# EAGLE design HominiPulseSensorControllerBoard (EAGLE 8.0.1)
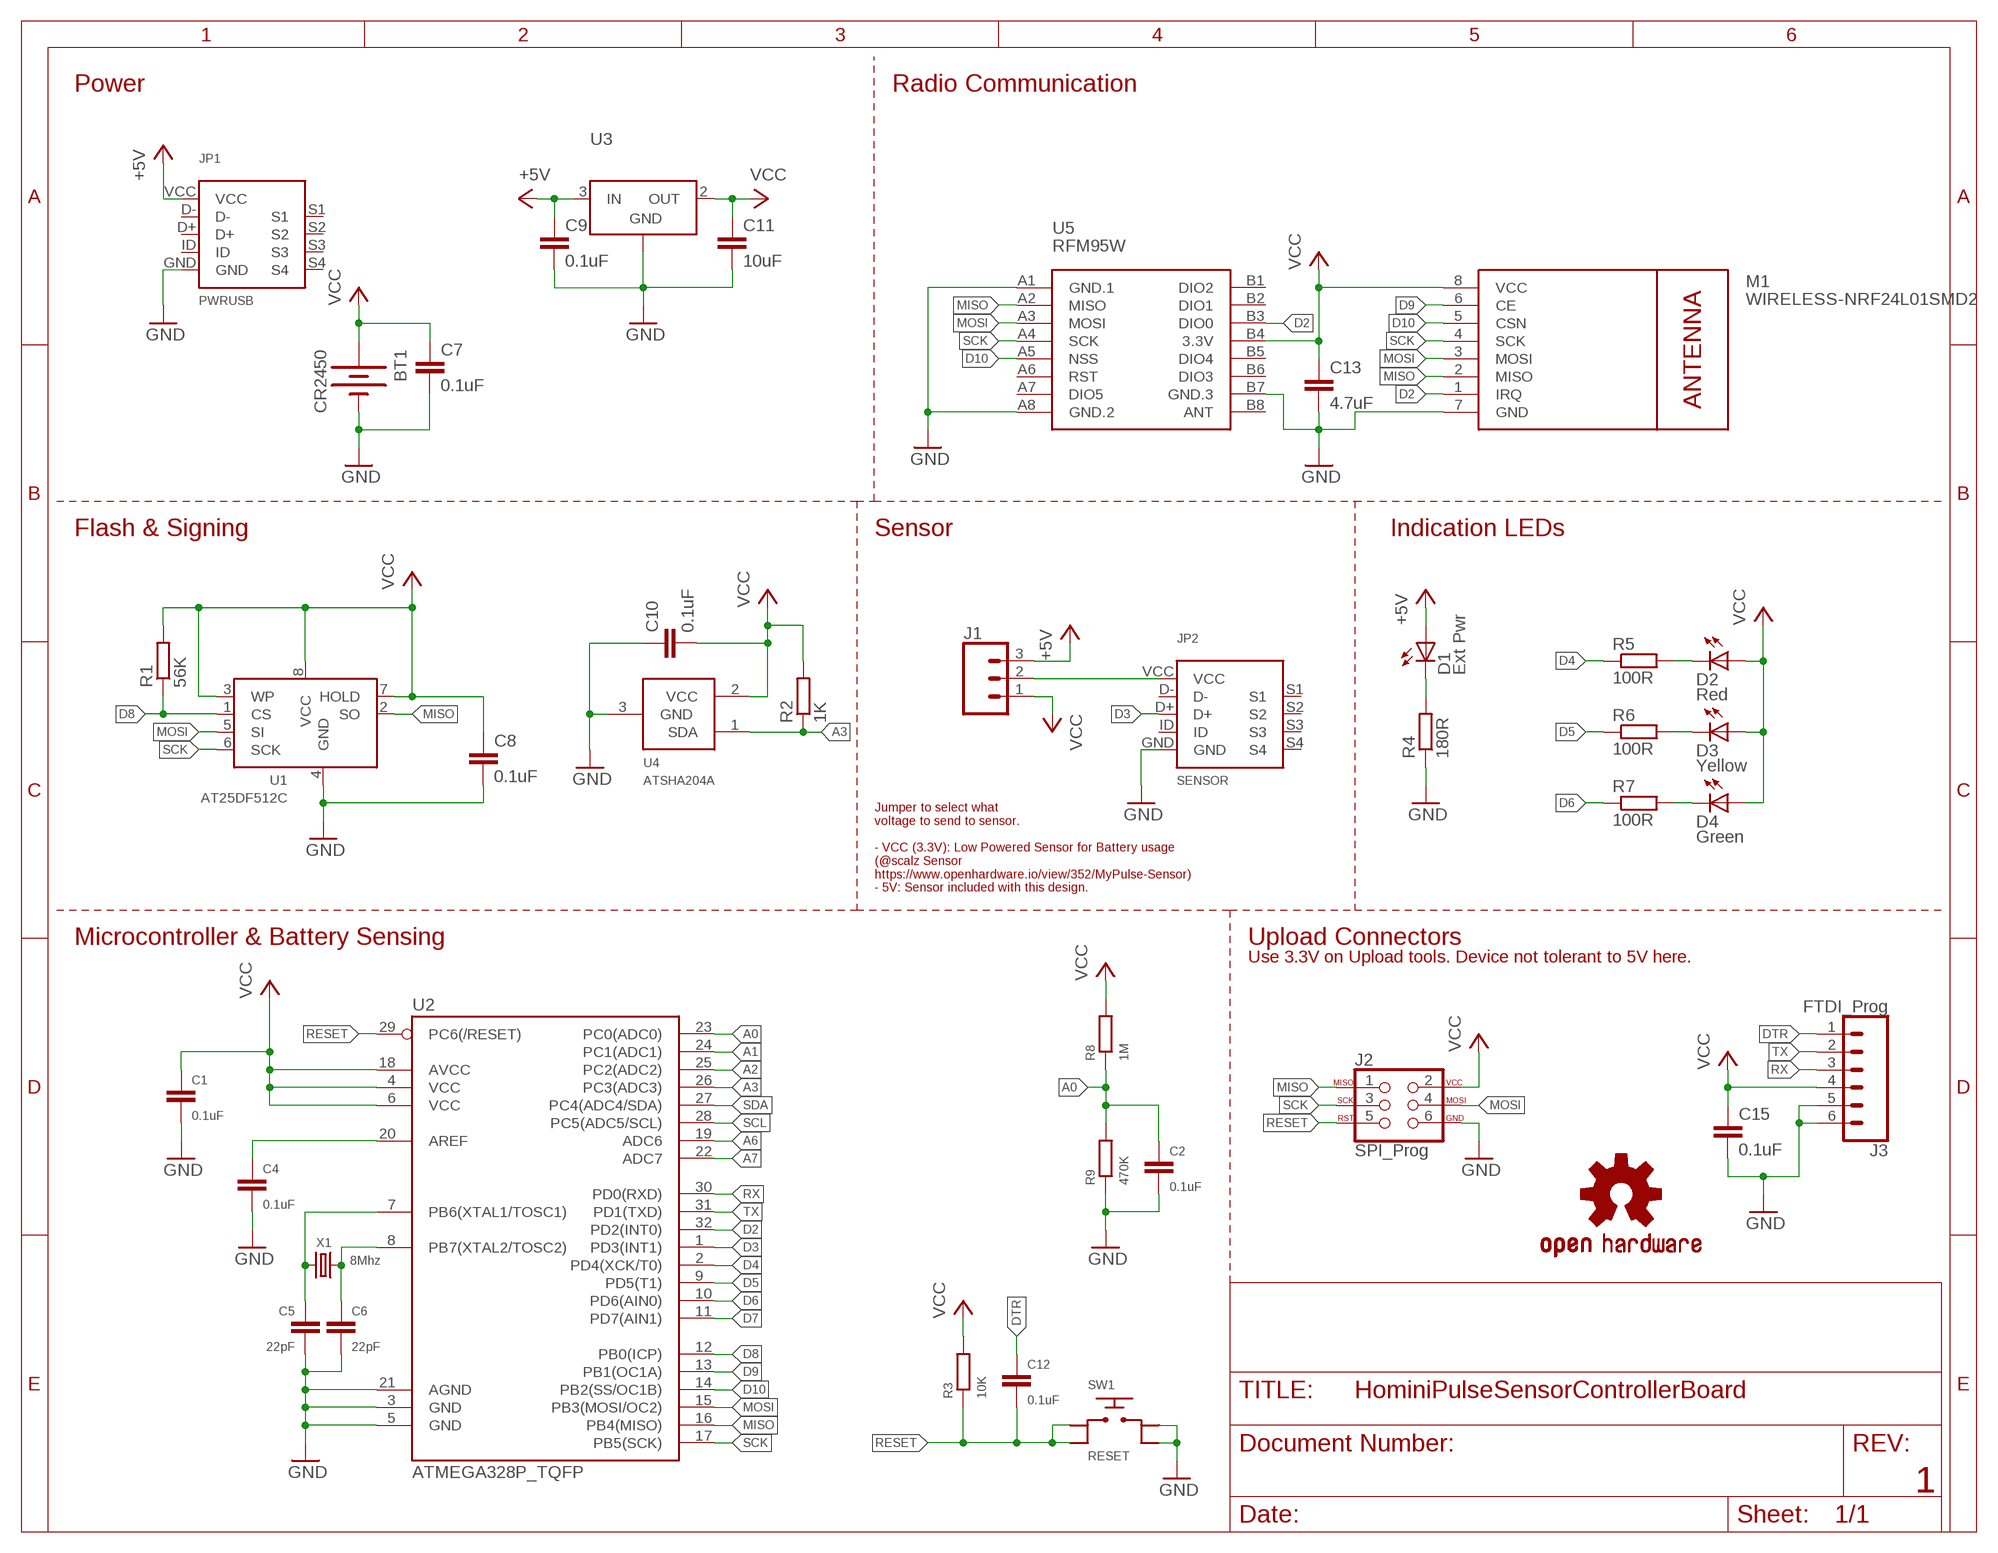
[diagram p0: schematic, sheet 1]

## Parts
BT1  CR2450  [BATTCON_24.5MM]
C1  0.1uF  C-EUC0603  [C0603]
C2  0.1uF  C-EUC0603  [C0603]
C4  0.1uF  C-EUC0603  [C0603]
C5  22pF  C-EUC0603  [C0603]
C6  22pF  C-EUC0603  [C0603]
C7  0.1uF  C-EUC0603  [C0603]
C8  0.1uF  C-EUC0603  [C0603]
C9  0.1uF  C-EUC0603  [C0603]
C10  0.1uF  C-EUC0603  [C0603]
C11  10uF  C-EUC0603  [C0603]
C12  0.1uF  C-EUC0603  [C0603]
C13  4.7uF  C-EUC0603  [C0603]
C15  0.1uF  C-EUC0603  [C0603]
D1  Ext Pwr  LED3MM  [LED3MM]
D2  Red  LED3MM  [LED3MM]
D3  Yellow  LED3MM  [LED3MM]
D4  Green  LED3MM  [LED3MM]
J1  CONN_03  [1X03]
J2  SPI_Prog  AVR_SPI_PROG_3X2PTH  [2X3]
J3  FTDI_Prog  CONN_06NO_SILK_FEMALE_PTH  [1X06_NO_SILK]
JP1  PWRUSB  MICROUSBSMD  [MICROUSBSMD]
JP2  SENSOR  MICROUSBSMD  [MICROUSBSMD]
LOGO1  OSHW-LOGOM  [OSHW-LOGO-M]
M1  WIRELESS-NRF24L01SMD2  [WIRELESS-NRF24L01-SMD-2]
R1  56K  R-EU_R0603  [R0603]
R2  1K  R-EU_R0603  [R0603]
R3  10K  R-EU_R0603  [R0603]
R4  180R  R-EU_R0603  [R0603]
R5  100R  R-EU_R0603  [R0603]
R6  100R  R-EU_R0603  [R0603]
R7  100R  R-EU_R0603  [R0603]
R8  1M  R-EU_R0603  [R0603]
R9  470K  R-EU_R0603  [R0603]
SW1  RESET  SMD5X5X1.5MM  [SMD5X5X1.5MM]
U1  AT25DF512C  [SOIC-8]
U2  ATMEGA328P_TQFP  [TQFP32-08]
U3  LD1117V33  [SOC-223]
U4  ATSHA204A  [SOT23]
U5  RFM95W  WIRELESS-LORA-RFM95W#SMD  [WIRELESS-LORA-RFM95W#SMD]
X1  8Mhz  HC-49S-SMT  [HC-49S-SMT]

## Nets
+5V: C9.1 D1.A J1.3 JP1.VCC U3.3(IN)
A0: C2.1 R8.1 R9.2 U2.23(PC0(ADC0))
A1: U2.24(PC1(ADC1))
A2: U2.25(PC2(ADC2))
A3: R2.1 U2.26(PC3(ADC3)) U4.1(SDA)
A6: U2.19(ADC6)
A7: U2.22(ADC7)
D2: M1.1(IRQ) U2.32(PD2(INT0)) U5.B3(DIO0)
D3: JP2.D+ U2.1(PD3(INT1))
D4: R5.1 U2.2(PD4(XCK/T0))
D5: R6.1 U2.9(PD5(T1))
D6: R7.1 U2.10(PD6(AIN0))
D7: U2.11(PD7(AIN1))
D8: R1.1 U1.1(CS) U2.12(PB0(ICP))
D9: M1.6(CE) U2.13(PB1(OC1A))
D10: M1.5(CSN) U2.14(PB2(SS/OC1B)) U5.A5(NSS)
DTR: C12.1 J3.1
GND: BT1.2(-) C1.2 C2.2 C4.2 C5.2 C6.2 C7.2 C8.2 C9.2 C10.1 C11.2 C13.2 C15.2 J2.6 J3.5 J3.6 JP1.GND JP2.GND M1.7(GND) R4.1 R9.1 SW1.3 SW1.4 U1.4(GND) U2.3(GND) U2.5(GND) U2.21(AGND) U3.1(GND) U4.3(GND) U5.A1(GND.1) U5.A8(GND.2) U5.B7(GND.3)
MISO: J2.1 M1.2(MISO) U1.2(SO) U2.16(PB4(MISO)) U5.A2(MISO)
MOSI: J2.4 M1.3(MOSI) U1.5(SI) U2.15(PB3(MOSI/OC2)) U5.A3(MOSI)
N$1: C6.1 U2.8(PB7(XTAL2/TOSC2)) X1.1
N$2: C5.1 U2.7(PB6(XTAL1/TOSC1)) X1.2
N$3: C4.1 U2.20(AREF)
N$4: J1.2 JP2.VCC
N$7: D1.K(C) R4.2
N$8: D2.K(C) R5.2
N$9: D3.K(C) R6.2
N$10: D4.K(C) R7.2
RESET: C12.2 J2.5 R3.1 SW1.1 SW1.2 U2.29(PC6(/RESET))
RX: J3.3 U2.30(PD0(RXD))
SCK: J2.3 M1.4(SCK) U1.6(SCK) U2.17(PB5(SCK)) U5.A4(SCK)
SCL: U2.28(PC5(ADC5/SCL))
SDA: U2.27(PC4(ADC4/SDA))
TX: J3.2 U2.31(PD1(TXD))
VCC: BT1.1(+) C1.1 C7.1 C8.1 C10.2 C11.1 C13.1 C15.1 D2.A D3.A D4.A J1.1 J2.2 J3.4 M1.8(VCC) R1.2 R2.2 R3.2 R8.2 U1.3(WP) U1.7(HOLD) U1.8(VCC) U2.4(VCC) U2.6(VCC) U2.18(AVCC) U3.2(OUT) U4.2(VCC) U5.B4(3.3V)
Unconnected: JP1.D+ JP1.D- JP1.ID JP1.S1 JP1.S2 JP1.S3 JP1.S4 JP2.D- JP2.ID JP2.S1 JP2.S2 JP2.S3 JP2.S4 U5.A6(RST) U5.A7(DIO5) U5.B1(DIO2) U5.B2(DIO1) U5.B5(DIO4) U5.B6(DIO3) U5.B8(ANT)

## Notes on the sheet
- Power | Radio Communication
- Flash & Signing | Sensor | Indication LEDs
- Jumper to select what 
  voltage to send to sensor.
  
  - VCC (3.3V): Low Powered Sensor for Battery usage
  (@scalz Sensor
  https://www.openhardware.io/view/352/MyPulse-Sensor)
  - 5V: Sensor included with this design.
- Microcontroller & Battery Sensing | Upload Connectors
- Use 3.3V on Upload tools. Device not tolerant to 5V here.
- 1

## Library data of the parts
BT1 = Misc:CR2450
C1 C2 C4-C13 C15 = rcl:C-EU: CAPACITOR, European symbol
D1-D4 = adafruit:LED: LED OSRAM: - CHIPLED LG R971, LG N971, LY N971, LG Q971, LY Q971, LO R971, LY R971 LH N974, LH R974 LS Q976, LO Q976, LY Q976 LO Q996 - Hyper CHIPLED LW Q18S LB Q993, LB Q99A, LB R99A - SideLED LS A670, LO A670, LY A670, LG A670, LP A670 LB A673, LV A673, LT A673, LW A673 LH A674 LY A675 LS A676, LA A676, LO A676, LY A676, LW A676 LS A679, LY A679, LG A679 - Hyper Micro SIDELED® LS Y876, LA Y876, LO Y876, LY Y876 LT Y87S - SmartLED LW L88C, LW L88S LB L89C, LB L89S, LG L890 LS L89K, LO L89K, LY L89K LS L896, LA L896, LO L896, LY L896 - TOPLED LS T670, LO T670, LY T670, LG T670, LP T670 LSG T670, LSP T670, LSY T670, LOP T670, LYG T670 LG T671, LOG T671, LSG T671 LB T673, LV T673, LT T673, LW T673 LH T674 LS T676, LA T676, LO T676, LY T676, LB T676, LH T676, LSB T676, LW T676 LB T67C, LV T67C, LT T67C, LS T67K, LO T67K, LY T67K, LW E67C LS E67B, LA E67B, LO E67B, LY E67B, LB E67C, LV E67C, LT E67C LW T67C LS T679, LY T679, LG T679 LS T770, LO T770, LY T770, LG T770, LP T770 LB T773, LV T773, LT T773, LW T773 LH T774 LS E675, LA E675, LY E675, LS T675 LS T776, LA T776, LO T776, LY T776, LB T776 LHGB T686 LT T68C, LB T68C - Hyper Mini TOPLED® LB M676 - Mini TOPLED Santana® LG M470 LS M47K, LO M47K, LY M47K Source: http://www.osram.convergy.de/
J1 = SparkFun-Connectors:CONN_03: Multi connection point. Often used as Generic Header-pin footprint for 0.1 inch spaced/style header connections On any of the 0.1 inch spaced packages, you can populate with these: Break Away Headers - Straight <https://www.sparkfun.com/products/116> (PRT-00116) Break Away Male Headers - Right Angle <https://www.sparkfun.com/products/553> (PRT-00553) Female Headers <https://www.sparkfun.com/products/115> (PRT-00115) Break Away Headers - Machine Pin <https://www.sparkfun.com/products/117> (PRT-00117) Break Away Female Headers - Swiss Machine Pin <https://www.sparkfun.com/products/743> (PRT-00743) Stackable Header - 3 Pin (Female, 0.1") <https://www.sparkfun.com/products/13875> (PRT-13875) For SCREWTERMINALS and SPRING TERMINALS visit here: Screw Terimnals on SparkFun.com <https://www.sparkfun.com/search/results?term=Screw+Terminals> (5mm/3.5mm/2.54mm spacing) This device is also useful as a general connection point to wire up your design to another part of your project. Our various solder wires solder well into these plated through hole pads. Hook-Up Wire - Assortment (Stranded, 22 AWG) <https://www.sparkfun.com/products/11375> (PRT-11375) Hook-Up Wire - Assortment (Solid Core, 22 AWG) <https://www.sparkfun.com/products/11367> (PRT-11367) View the entire wire category on our website here <https://www.sparkfun.com/categories/141> Special notes: Molex polarized connector foot print use with SKU : PRT-08232 with associated crimp pins and housings.
J2 = SparkFun-Connectors:AVR_SPI_PROG_3X2: AVR ISP 6 Pin This is the reduced ISP connector for AVR programming. Common on Arduino. This footprint will take up less PCB space and can be used with a 10-pin to 6-pin adapter such as SKU: BOB-08508 **Special note about "TEST_POINT" package. The stop mask is on the top side, so if you want your programming test points to be on the bottom of your board, make sure to place this package on the bottom side of the board. This also ensure that the orientation to program from the bottom side will be correct. SparkFun Products: SparkFun ISP Pogo Adapter <https://www.sparkfun.com/products/11591> - NS Tiny AVR Programmer <https://www.sparkfun.com/products/11801> -PTH
J3 = SparkFun-Connectors:CONN_06: Multi connection point. Often used as Generic Header-pin footprint for 0.1 inch spaced/style header connections On any of the 0.1 inch spaced packages, you can populate with these: Break Away Headers - Straight <https://www.sparkfun.com/products/116> (PRT-00116) Break Away Male Headers - Right Angle <https://www.sparkfun.com/products/553> (PRT-00553) Female Headers <https://www.sparkfun.com/products/115> (PRT-00115) Break Away Headers - Machine Pin <https://www.sparkfun.com/products/117> (PRT-00117) Break Away Female Headers - Swiss Machine Pin <https://www.sparkfun.com/products/743> (PRT-00743) Arduino Stackable Header - 6 Pin <https://www.sparkfun.com/products/9280> (PRT-09280) For SCREWTERMINALS and SPRING TERMINALS visit here: Screw Terimnals on SparkFun.com <https://www.sparkfun.com/search/results?term=Screw+Terminals> (5mm/3.5mm/2.54mm spacing) This device is also useful as a general connection point to wire up your design to another part of your project. Our various solder wires solder well into these plated through hole pads. Hook-Up Wire - Assortment (Stranded, 22 AWG) <https://www.sparkfun.com/products/11375> (PRT-11375) Hook-Up Wire - Assortment (Solid Core, 22 AWG) <https://www.sparkfun.com/products/11367> (PRT-11367) View the entire wire category on our website here <https://www.sparkfun.com/categories/141>; PROD_ID: CONN-08437
JP1 JP2 = Misc:MICROUSBSMD
LOGO1 = SparkFun-Aesthetics:OSHW-LOGO: Open-Source Hardware (OSHW) Logo This logo indicates the piece of hardware it is found on incorporates a OSHW license and/or adheres to the definition of open source hardware found here: http://freedomdefined.org/OSHW
M1 = nrf24l01SMD-GertSanders:WIRELESS-NRF24L01: 2.4 GHz Wireless Module based on NRF24L01 chip
R1-R9 = rcl:R-EU_: RESISTOR, European symbol
SW1 = Buttons:SMD5X5X1.5MM
U1 = Misc:AT25DF512C
U2 = SparkFun-IC-Microcontroller:ATMEGA328P_TQFP: Popular 328P in QFP Storefront component: ATmega328 - TQFP <https://www.sparkfun.com/products/13448> (COM-13448) Datasheet <http://www.sparkfun.com/datasheets/Components/SMD/ATMega328.pdf> SparkFun Products SparkFun RedBoard - Programmed with Arduino <https://www.sparkfun.com/products/12757> (DEV-12757) Arduino Pro Mini 328 - 5V/16MHz <https://www.sparkfun.com/products/11113> (DEV-11113) Arduino Pro Mini 328 - 3.3V/8MHz <https://www.sparkfun.com/products/11114> (DEV-11114) SparkFun OpenLog <https://www.sparkfun.com/products/13712> (DEV-13712) SparkFun MicroView - OLED Arduino Module <https://www.sparkfun.com/products/12923> (DEV-12923) SparkFun Digital Sandbox <https://www.sparkfun.com/products/12651> (DEV-12651) SparkFun PicoBoard <https://www.sparkfun.com/products/11888> (WIG-11888) Arduino Fio <https://www.sparkfun.com/products/10116> (DEV-10116) LilyPad Arduino 328 Main Board <https://www.sparkfun.com/products/13342> (DEV-13342) SparkFun RedStick <https://www.sparkfun.com/products/13741> (DEV-13741) LilyPad MP3 <https://www.sparkfun.com/products/11013> (DEV-11013) LilyPad Arduino SimpleSnap <https://www.sparkfun.com/products/10941> (DEV-10941) SparkFun Stepoko <https://www.sparkfun.com/products/13899> (ROB-13899) SparkFun Geiger Counter <https://www.sparkfun.com/products/11345> (SEN-11345) SparkFun EL Sequencer <https://www.sparkfun.com/products/12781> (COM-12781) Arduino Pro 328 - 5V/16MHz <https://www.sparkfun.com/products/10915> (DEV-10915) CryptoCape <https://www.sparkfun.com/products/12773> (DEV-12773) SparkFun IR Thermometer Evaluation Board - MLX90614 <https://www.sparkfun.com/products/10740> (SEN-10740) SparkFun RedBot Mainboard <https://www.sparkfun.com/products/12097> (ROB-12097) Arduino Pro 328 - 3.3V/8MHz <https://www.sparkfun.com/products/10914> (DEV-10914) SparkFun Block for Intel® Edison - Arduino <https://www.sparkfun.com/products/13036> (DEV-13036) SparkFun Simon Says - Surface Mount Soldering Kit <https://www.sparkfun.com/products/10935> (KIT-10935) SparkFun 7-Segment Serial Display - Red <https://www.sparkfun.com/products/11441> (COM-11441) SparkFun 7-Segment Serial Display - White <https://www.sparkfun.com/products/11629> (COM-11629) SparkFun 7-Segment Serial Display - Yellow <https://www.sparkfun.com/products/11443> (COM-11443) SparkFun 7-Segment Serial Display - Kelly Green <https://www.sparkfun.com/products/11440> (COM-11440) SparkFun 7-Segment Serial Display - Blue <https://www.sparkfun.com/products/11442> (COM-11442) SparkFun OpenSegment Serial Display - 20mm (Blue) <https://www.sparkfun.com/products/11647> (COM-11647) SparkFun OpenSegment Serial Display - 20mm (Green) <https://www.sparkfun.com/products/11646> (COM-11646) SparkFun OpenSegment Serial Display - 20mm (White) <https://www.sparkfun.com/products/11648> (COM-11648) SparkFun OpenSegment Serial Display - 20mm (Red) <https://www.sparkfun.com/products/11644> (COM-11644) SparkFun OpenSegment Serial Display - 20mm (Yellow) <https://www.sparkfun.com/products/11645> (COM-11645) SparkFun OpenSegment Shield <https://www.sparkfun.com/products/13190> (DEV-13190); PROD_ID: IC-09069
U3 = Misc:LD1117V33
U4 = Sensor:ATSHA204A
U5 = diy-modules:WIRELESS-LORA-RFM95W: 868/915 MHz LoRa Radio Transceiver Module based on SX1276 chip Click here to find device on ebay.com <http://www.ebay.com/sch/RFM95W+transceiver>
X1 = crystal2:HC-49S-SMT

## Board
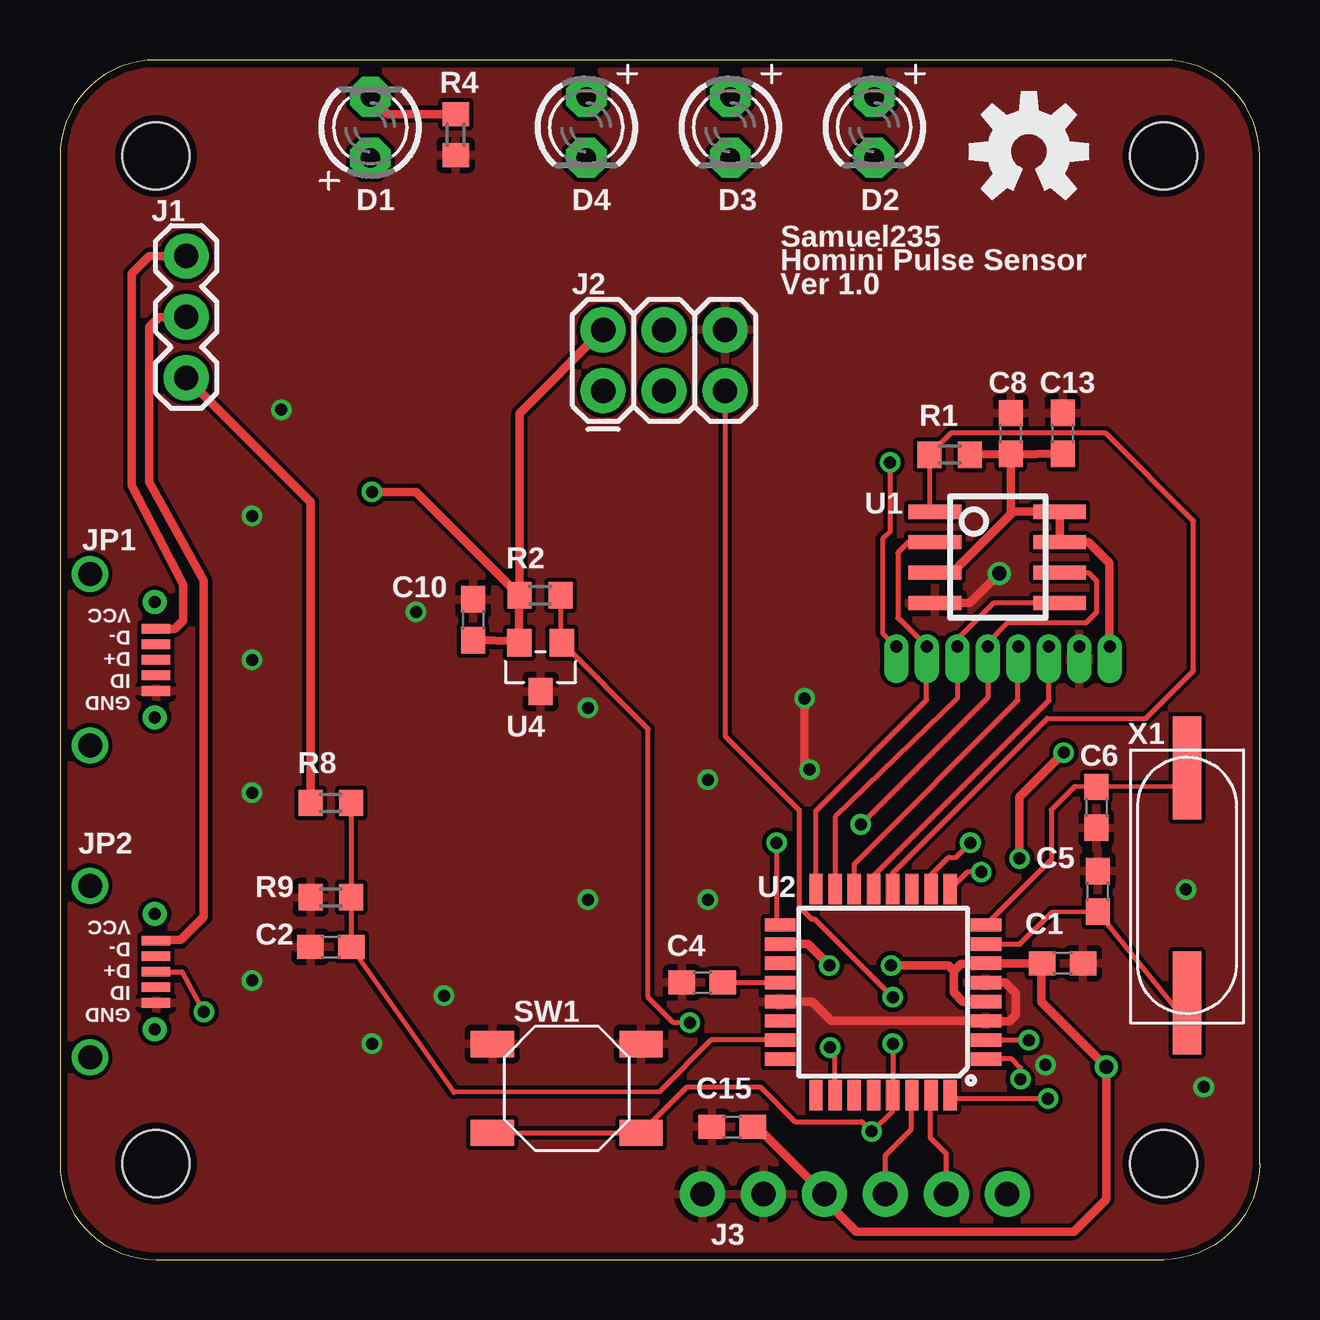
[diagram p1: board, top side]
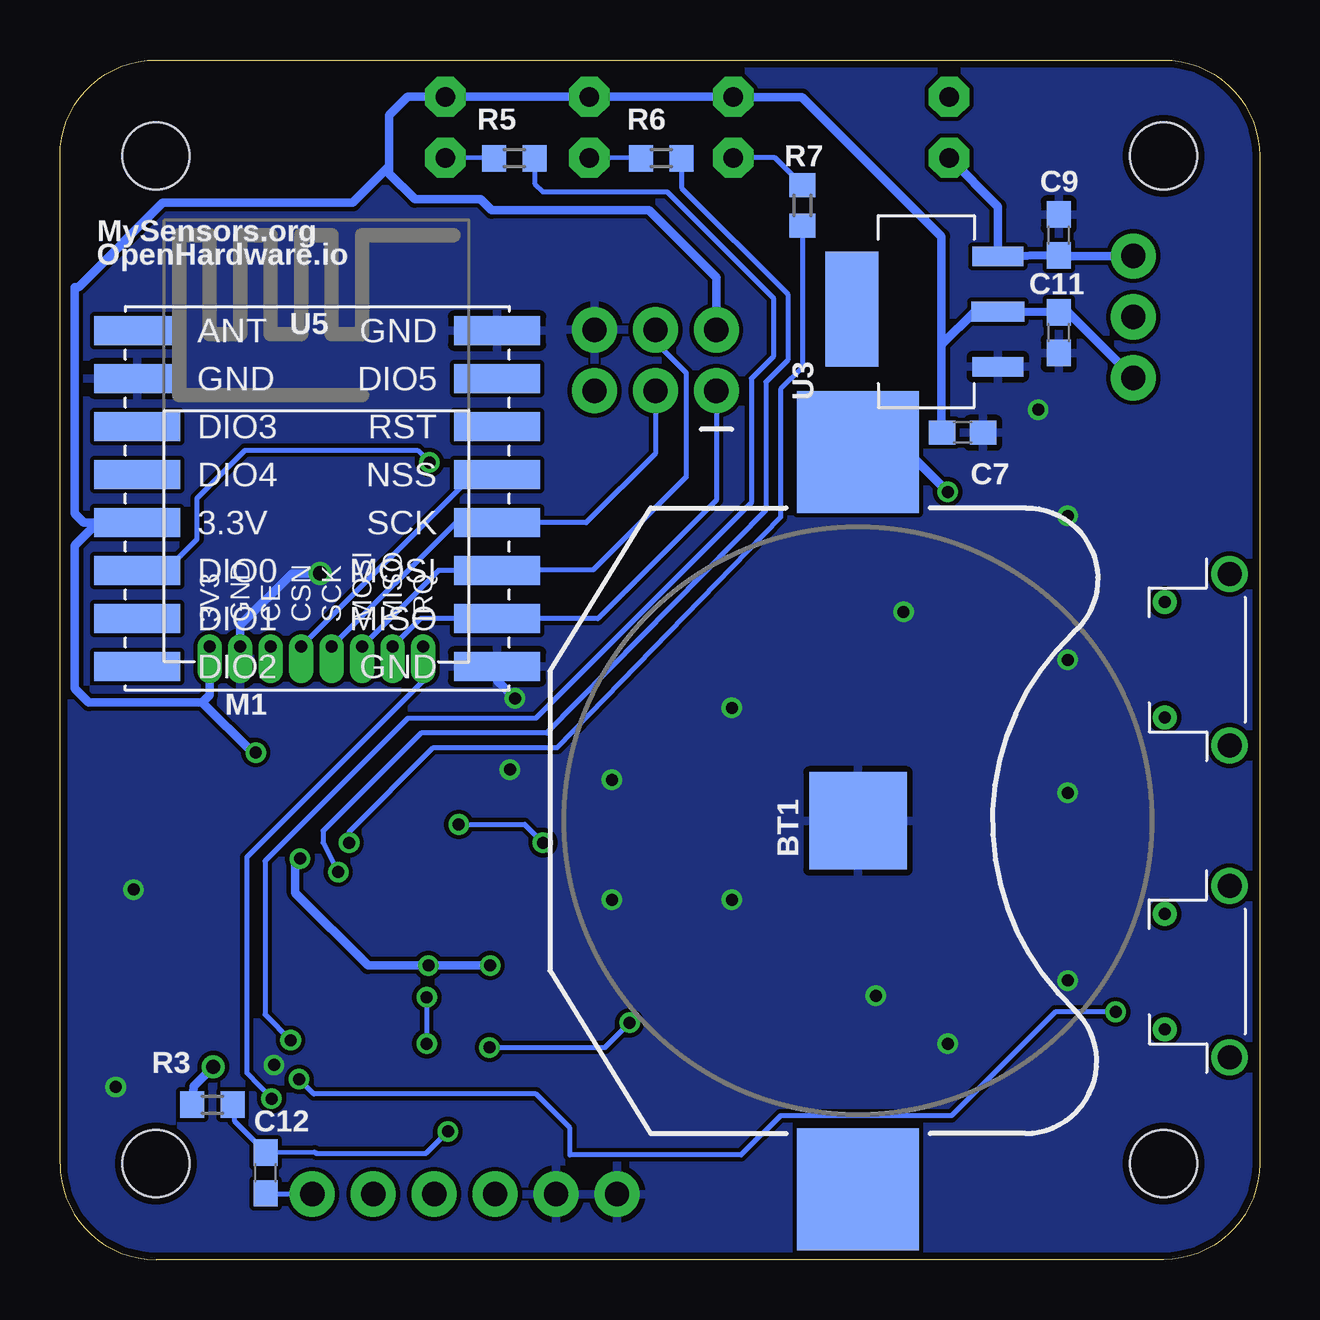
[diagram p2: board, bottom side, seen from below]

Size 50 x 50 mm. Coordinates in mm from the lower left corner, seen from the top.
Outline: 4,0 46,0 arc90 50,4 50,46 arc90 46,50 4,50 arc90 0,46 0,4 arc90 4,0
Copper layers (1*16): Top 0.035mm / dielectric 1.5011mm / Bottom 0.035mm
Design rules "1450629659191-gert_sanders *": minimum track width 7mil, minimum drill 13mil, track to track 7mil, track to pad 7mil, pad to pad 7mil, via to via 7mil, smd to smd 7mil, copper to edge 0.3mm, drill to drill 10mil, minimum pad ring 10mil, minimum via ring 7mil, stop-mask expansion 3mil, vias tented up to drill 14mil, thermal gap 10mil
Holes 2.8 mm at 4,4 46,4 4,46 46,46

### Footprints (pad centres in the part's own frame; a part is rotated, then mirrored left to right if it is on the bottom)
BATTCON_24.5MM = smd 5.08 x 5.08: 1 -15.367,0; 3 15.367,0 | smd 4.064 x 4.064: 2 0,0
C0603 = smd 1.1 x 1: 1 -0.85,0; 2 0.85,0
LED3MM = drill 0.813 pad 1.676 octagon: A -1.27,0; K 1.27,0
1X03 = drill 1.016 pad 1.88: 1 0,0; 2 2.54,0; 3 5.08,0
2X3 = drill 1.016 pad 1.88: 1 0,0; 2 0,2.54; 3 2.54,0; 4 2.54,2.54; 5 5.08,0; 6 5.08,2.54
1X06_NO_SILK = drill 1.016 pad 1.88: 1 0,0; 2 2.54,0; 3 5.08,0; 4 7.62,0; 5 10.16,0; 6 12.7,0
MICROUSBSMD = smd 0.4 x 1.2: D+ 0,0; D- -0.65,0; GND 1.3,0; ID 0.65,0; VCC -1.3,0 | drill 1: S1 -3.575,-2.75; S2 3.575,-2.75 | drill 0.5: S3 -2.4,-0.05; S4 2.4,-0.05
WIRELESS-NRF24L01-SMD-2 = drill 0.5 pad 1.016 offset: 1 1.905,0; 2 1.905,1.27; 3 1.905,2.54; 4 1.905,3.81; 5 1.905,5.08; 6 1.905,6.35; 7 1.905,7.62; 8 1.905,8.89
R0603 = smd 1 x 1.1: 1 -0.85,0; 2 0.85,0
SMD5X5X1.5MM = smd 1.8 x 1.1: 1 0.9,4.25; 2 7.1,4.25; 3 0.9,0.55; 4 7.1,0.55
SOIC-8 = smd 2.2 x 0.6: 1 -2.55,1.89; 2 -2.55,0.62; 3 -2.55,-0.65; 4 -2.55,-1.92; 5 2.65,-1.92; 6 2.65,-0.65; 7 2.65,0.62; 8 2.65,1.89
TQFP32-08 = smd 1.27 x 0.559: 1 -4.293,2.8; 2 -4.293,2; 3 -4.293,1.2; 4 -4.293,0.4; 5 -4.293,-0.4; 6 -4.293,-1.2; 7 -4.293,-2; 8 -4.293,-2.8; 17 4.293,-2.8; 18 4.293,-2; 19 4.293,-1.2; 20 4.293,-0.4; 21 4.293,0.4; 22 4.293,1.2; 23 4.293,2; 24 4.293,2.8 | smd 0.559 x 1.27: 9 -2.8,-4.293; 10 -2,-4.293; 11 -1.2,-4.293; 12 -0.4,-4.293; 13 0.4,-4.293; 14 1.2,-4.293; 15 2,-4.293; 16 2.8,-4.293; 25 2.8,4.293; 26 2,4.293; 27 1.2,4.293; 28 0.4,4.293; 29 -0.4,4.293; 30 -1.2,4.293; 31 -2,4.293; 32 -2.8,4.293
SOC-223 = smd 0.81 x 2.11: 1 -2.3,-4.99; 3 2.3,-4.99 | smd 0.85 x 2.2: 2 0,-4.99 | smd 4.8 x 2.2: P$1 0.1,1.1
SOT23 = smd 1.016 x 1.143: 1 -0.889,-1.016; 2 0.889,-1.016; 3 0,1.016
WIRELESS-LORA-RFM95W#SMD = smd 3.6 x 1.2: A1 -7.5,7; A2 -7.5,5; A3 -7.5,3; A4 -7.5,1; A5 -7.5,-1; A6 -7.5,-3; A7 -7.5,-5; A8 -7.5,-7; B1 7.5,7; B2 7.5,5; B3 7.5,3; B4 7.5,1; B5 7.5,-1; B6 7.5,-3; B7 7.5,-5; B8 7.5,-7
HC-49S-SMT = smd 4.3 x 1.2: 1 2.15,2.35; 2 11.95,2.35

### Placement (x,y rotation side)
BT1  16.74,18.29 270 bottom
C1  41.79,12.35 0 top
C2  11.29,13.03 180 top
C4  26.77,11.55 180 top
C5  43.26,15.34 90 top
C6  43.19,18.85 270 top
C7  12.38,34.46 0 bottom
C8  39.63,34.43 90 top
C9  8.37,42.71 90 bottom
C10  17.22,26.66 270 top
C11  8.37,38.63 270 bottom
C12  41.43,3.61 90 bottom
C13  41.8,34.43 90 top
C15  28.02,5.53 180 top
D1  12.94,47.19 90 top
D2  33.94,47.19 270 top
D3  27.94,47.19 270 top
D4  21.94,47.19 270 top
J1  5.26,36.75 90 top
J2  22.64,36.21 0 top
J3  39.48,2.73 180 top
JP1  4,25 270 top
JP2  4,12 270 top
LOGO1  40.39,46.18 0 top
M1  34.86,23.64 90 bottom
R1  37.08,33.54 0 top
R2  20.01,27.69 180 top
R3  43.65,6.45 180 bottom
R4  16.5,46.88 90 top
R5  31.06,45.9 180 bottom
R6  24.94,45.9 180 bottom
R7  19.05,43.94 90 bottom
R8  11.29,19.03 180 top
R9  11.29,15.1 0 top
SW1  25.12,9.53 180 top
U1  39.02,29.28 0 top
U2  34.31,11.15 180 top
U3  15.89,39.51 90 bottom
U4  20.03,24.69 180 top
U5  39.28,31.72 180 bottom
X1  44.63,22.64 270 top

### Tracks (layer width: path | path; a pad name or v marks a point on that pad's centre or on a via)
+5V
  Top 0.356: J1.3 3.72,41.83 2.98,41.09 2.98,32.26 5.13,28.13 5.13,26.64 4.77,26.29 JP1.VCC
  Bottom 0.356: J1.3 8.37,41.83 C9.1 10.88,41.83 U3.3 10.9,43.89 D1.A
A0
  Top 0.203: R8.1 R9.2 C2.1 16.42,6.97 25,7 27.14,9.15 U2.23
A3  (via drill 0.5)
  Top 0.203: R2.1 20.86,25.77 U4.1 24.52,22.11 24.52,10.94 25.58,9.87 v26.26,9.87 | U2.26 32.31,8.63 v32.1,8.84
  Bottom 0.203: v32.1,8.84 27.29,8.84 v26.26,9.87
D2  (via drill 0.5)
  Top 0.203: v34.59,33.22 34.59,30.33 34.29,30.02 34.29,26.12 M1.1 | v41.19,6.71 37.26,6.71 U2.32
  Bottom 0.203: U5.B3 45.59,28.72 44.29,30.02 44.29,31.73 42.29,33.73 35.1,33.73 v34.59,33.22 | M1.1 34.86,24.12 42.22,16.76 42.22,7.77 v41.19,6.71
D3  (via drill 0.5)
  Top 0.203: JP2.D+ 5.08,12 v6,10.32 | v40.03,7.52 40.03,8 39.68,8.36 U2.1
  Bottom 0.203: v40.03,7.52 39.42,6.9 30.16,6.9 28.74,5.48 28.74,4.36 21.61,4.36 19.97,6 12.84,6 8.52,10.32 v6,10.32
D4  (via drill 0.5)
  Top 0.203: v40.39,9.14 U2.2
  Bottom 0.203: R5.1 30.21,44.84 29.87,44.5 24.69,44.5 20.27,40.08 20.27,37.64 21.18,36.73 21.18,31.55 30.18,22.55 35.51,22.55 41.45,16.61 41.45,10.21 v40.39,9.14
D5  (via drill 0.5)
  Top 0.203: v38.41,16.15 37.83,16.15 U2.9
  Bottom 0.203: R6.1 24.09,44.66 19.66,40.23 19.66,37.49 20.57,36.58 20.57,31.24 29.72,21.95 34.95,21.95 39.04,17.87 39.04,17.38 v38.41,16.15
D6  (via drill 0.5)
  Top 0.203: U2.10 36.31,16.04 37.03,16.76 37.34,16.76 v37.95,17.37
  Bottom 0.203: R7.1 19.05,37.18 19.96,36.27 19.96,30.94 29.26,21.34 34.44,21.34 37.95,17.83 v37.95,17.37
D8
  Top 0.203: U2.12 34.71,16.12 41.15,22.55 45.26,22.55 47.24,24.54 47.24,30.79 43.59,34.44 37.13,34.44 R1.1 36.23,31.41 U1.1
D9
  Top 0.203: U2.13 33.91,15.98 41.22,23.3 41.22,25.54 M1.6
D10
  Top 0.203: U2.14 33.11,16.5 39.93,23.32 39.93,25.54 M1.5
  Bottom 0.203: M1.5 32.77,32.72 U5.A5
DTR
  Bottom 0.203: 39.65,2.73 J3.1 41.42,2.73 C12.1
GND  (via drill 0.5, 0.6)
  Top 0.356: U1.4 37.92,27.36 v39.16,28.6 | U2.5 39.39,11.55 39.84,11.1 39.84,10.19 39.58,9.94 38.61,9.94 U2.3 32.15,9.95 31.36,10.74 U2.21 | v31.03,23.39 31.03,20.63 v31.24,20.42
  Bottom 0.356: v39.16,28.6 40.32,28.6 42.48,26.44 M1.7 | U5.A1 31.78,24.14 v31.03,23.39
  other vias: 22,15 16,11 27,15 27,20 41.08,8.11 47.68,7.19 46.94,15.42 8,31 9.23,35.42 22,23 14.84,27 8,25 8,19.46 8,11.63 13,9
  pour Top: -1,51 51,51 51,-1 -1,-1
  pour Bottom: -2,52 52,52 52,-2 -2,-2
MISO
  Top 0.203: U1.2 35.36,29.9 34.92,29.47 34.92,26.72 34.96,26.72 M1.2 36.12,25.54 36.12,23.32 31.51,18.71 U2.16
  Bottom 0.203: M1.2 34.96,26.72 U5.A2 27.58,26.71 22.64,31.65 J2.1
MOSI
  Top 0.203: U1.5 38.91,27.36 37.42,25.87 37.42,25.56 M1.3 37.4,23.38 32.31,18.44 U2.15 | U2.15
  Bottom 0.203: M1.3 34.23,28.72 U5.A3 31.76,28.74 27.77,28.74 23.9,32.61 23.9,36.97 25.18,38.24 J2.4
N$1
  Top 0.203: 46.97,19.74 X1.1 46.97,19.72 C6.1 42.3,19.72 41.32,18.74 41.32,16.67 U2.8
N$2
  Top 0.203: X1.2 46.96,9.91 C5.1 41.34,14.47 40,13.13 38.62,13.13 U2.7
N$3
  Top 0.203: C4.1 U2.20
N$4
  Top 0.356: J1.2 4.14,39.29 3.71,38.86 3.71,32.41 5.99,28.3 5.99,14.28 5.04,13.32 4.02,13.32 JP2.VCC
N$7
  Top 0.356: R4.2 13.66,47.73 D1.K
N$8
  Bottom 0.203: R5.2 33.13,45.92 D2.K
N$9
  Bottom 0.203: R6.2 27.1,45.92 D3.K
N$10
  Bottom 0.203: R7.2 20.19,45.92 D4.K
RESET  (via drill 0.5)
  Top 0.203: SW1.2 SW1.1 26.13,7.19 29.19,7.19 30.64,5.74 33.42,5.74 v33.83,5.33 33.85,5.33 34.71,6.19 U2.29 v34.71,9 | J2.5 27.72,21.83 30.81,18.74 30.81,14.71 31.32,14.19 31.45,14.19 v34.71,10.94
  Bottom 0.203: v33.83,5.33 34.75,4.42 39.32,4.42 39.39,4.49 C12.2 42.73,5.79 R3.1 | v34.71,10.94 v34.71,9
RX
  Top 0.203: J3.3 34.4,4.34 35.48,5.42 35.48,6.83 U2.30
SCK  (via drill 0.5)
  Top 0.203: U1.6 42.87,28.63 43.21,28.3 43.21,26.97 42.76,26.52 39.47,26.52 38.67,25.73 M1.4 38.67,23.43 v33.38,18.14 | v29.87,17.37 29.87,14.09 U2.17
  Bottom 0.203: M1.4 33.5,30.72 U5.A4 28.06,30.71 25.18,33.59 J2.3 | v33.38,18.14 30.63,18.14 v29.87,17.37
TX
  Top 0.203: J3.2 36.94,4.41 36.29,5.07 36.29,6.83 U2.31
VCC  (via drill 0.5, 0.6)
  Top 0.356: R8.2 10.44,31.57 J1.1 | C1.1 40.92,12.09 | C13.1 39.64,33.56 C8.1 | C8.1 37.94,33.56 R1.2 | 39.63,31.07 C8.1 | 37.16,28.62 36.48,28.62 U1.3 37.2,28.63 39.63,31.07 | 39.63,31.07 39.74,31.17 U1.8 U1.7 42.85,29.9 43.74,29.02 43.74,25.56 M1.8 | 17.16,25.73 C10.2 19.06,25.79 U4.2 19.14,27.67 R2.2 | R2.2 19.16,35.27 J2.2 | C1.1 40.92,12.35 U2.6 38.58,12.32 37.55,12.32 37.26,12.03 | U2.4 37.64,10.75 37.26,11.13 37.26,12.03 | U2.18 31.18,13.15 v32.06,12.26 | v34.65,12.26 37.03,12.26 37.26,12.03 | v40,16.71 40,19.29 v41.84,21.13 | C1.1 40.9,12.33 40.9,10.74 v43.61,8.03 43.61,2.52 42.26,1.16 33.19,1.16 31.86,2.49 J3.4 29.06,5.53 C15.1 | v13,32 14.84,32 R2.2
  Bottom 0.356: J1.1 8.02,39.51 C11.1 U3.2 11.88,39.51 13.26,38.13 | 13.26,38.13 13.26,34.47 C7.1 | 13.26,38.13 13.26,42.65 19.06,48.45 21.92,48.45 D4.A D3.A D2.A 35.51,48.46 36.27,47.7 36.27,45.57 | 44.07,23.22 48.79,23.22 49.38,23.81 49.38,29.76 48.43,30.72 U5.B4 49.01,30.72 49.38,31.09 49.38,40.54 49.23,40.54 45.72,44.04 37.8,44.04 36.27,45.57 | 44.07,23.22 43.76,23.52 43.76,25.54 M1.8 | J2.2 22.64,40.93 25.45,43.74 32,43.74 32.46,44.2 35.2,44.2 36.27,45.26 36.27,45.57 | v32.06,12.26 v34.65,12.26 37.16,12.26 40.19,15.29 40.19,16.52 v40,16.71 | v41.84,21.13 41.98,21.13 44.07,23.22 | BT1.1 14.66,33.66 v13,32 | R3.2 44.43,7.21 v43.61,8.03

### Text on the board
tPlace: Samuel235 / Homini Pulse Sensor / Ver 1.0
bPlace: MySensors.org / OpenHardware.io